# Altium schematic sheet DriverIC.SchDoc
size A4
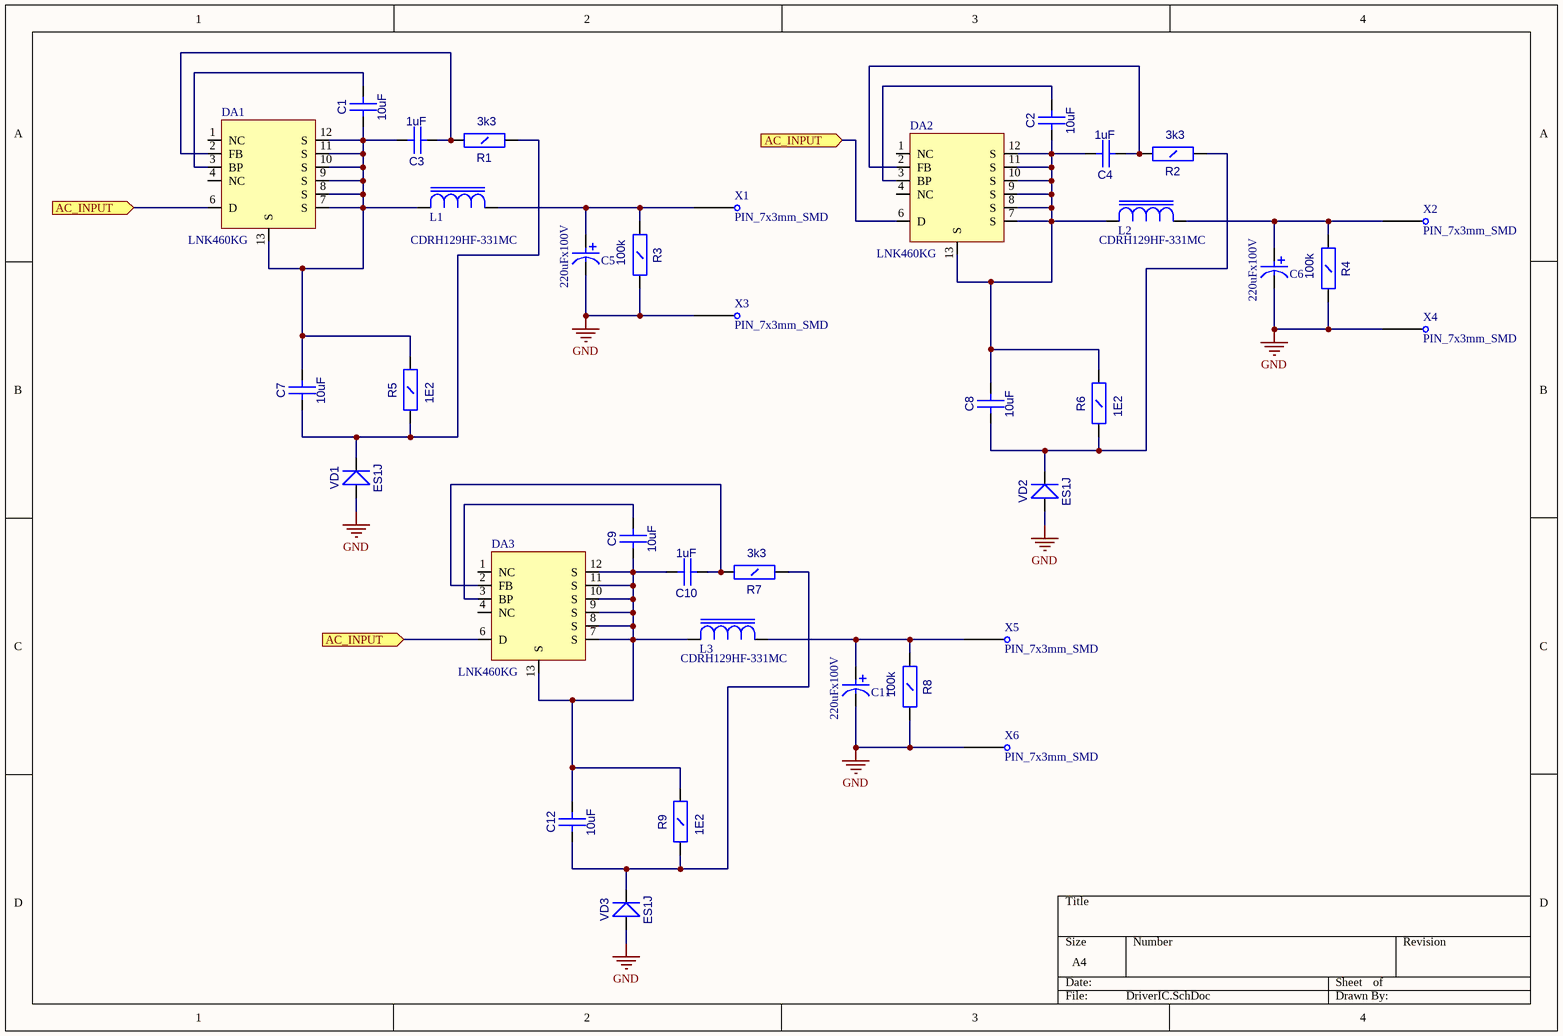
[diagram p0: DriverIC.SchDoc]

## Parts
C1  10uF  [CC1206]
C2  10uF  [CC1206]
C3  1uF  [CC1206]
C4  1uF  [CC1206]
C5  220uFx100V  [CAP_16x22_2]
C6  220uFx100V  [CAP_16x22_2]
C7  10uF  [CC1206]
C8  10uF  [CC1206]
C9  10uF  [CC1206]
C10  1uF  [CC1206]
C11  220uFx100V  [CAP_16x22_2]
C12  10uF  [CC1206]
DA1  LNK460KG  [eSOP-12]
DA2  LNK460KG  [eSOP-12]
DA3  LNK460KG  [eSOP-12]
L1  CDRH129HF-331MC  [IND_CDRH129]
L2  CDRH129HF-331MC  [IND_CDRH129]
L3  CDRH129HF-331MC  [IND_CDRH129]
R1  3k3  [RC1206]
R2  3k3  [RC1206]
R3  100k  [RC1206]
R4  100k  [RC1206]
R5  1E2  [RC1206]
R6  1E2  [RC1206]
R7  3k3  [RC1206]
R8  100k  [RC1206]
R9  1E2  [RC1206]
VD1  ES1J  [SMA]
VD2  ES1J  [SMA]
VD3  ES1J  [SMA]
X1  PIN_7x3mm_SMD  [PIN_7x3mm_SMD]
X2  PIN_7x3mm_SMD  [PIN_7x3mm_SMD]
X3  PIN_7x3mm_SMD  [PIN_7x3mm_SMD]
X4  PIN_7x3mm_SMD  [PIN_7x3mm_SMD]
X5  PIN_7x3mm_SMD  [PIN_7x3mm_SMD]
X6  PIN_7x3mm_SMD  [PIN_7x3mm_SMD]

## Ports
AC_INPUT (in)

## Nets
GND: C5.1 C6.1 C11.1 R3.2(B) R4.2(B) R8.2(B) VD1.1(A) VD2.1(A) VD3.1(A) X3.1 X4.1 X6.1
AC_INPUT: DA1.6(D) DA2.6(D) DA3.6(D) ; port AC_INPUT
NetC1_1: C1.1(A) C3.2(B) C7.2(B) DA1.7(S) DA1.8(S) DA1.9(S) DA1.10(S) DA1.11(S) DA1.12(S) DA1.13(S) L1.1(A) R5.2(B)
NetC1_2: C1.2(B) DA1.3(BP)
NetC2_1: C2.1(A) C4.2(B) C8.2(B) DA2.7(S) DA2.8(S) DA2.9(S) DA2.10(S) DA2.11(S) DA2.12(S) DA2.13(S) L2.1(A) R6.2(B)
NetC2_2: C2.2(B) DA2.3(BP)
NetC3_1: C3.1(A) DA1.2(FB) R1.2(B)
NetC4_1: C4.1(A) DA2.2(FB) R2.2(B)
NetC5_2: C5.2 L1.2(B) R3.1(A) X1.1
NetC6_2: C6.2 L2.2(B) R4.1(A) X2.1
NetC7_1: C7.1(A) R1.1(A) R5.1(A) VD1.2(K)
NetC8_1: C8.1(A) R2.1(A) R6.1(A) VD2.2(K)
NetC9_1: C9.1(A) C10.2(B) C12.2(B) DA3.7(S) DA3.8(S) DA3.9(S) DA3.10(S) DA3.11(S) DA3.12(S) DA3.13(S) L3.1(A) R9.2(B)
NetC9_2: C9.2(B) DA3.3(BP)
NetC10_1: C10.1(A) DA3.2(FB) R7.2(B)
NetC11_2: C11.2 L3.2(B) R8.1(A) X5.1
NetC12_1: C12.1(A) R7.1(A) R9.1(A) VD3.2(K)

Not connected (* = marked no-connect by the designer): DA1 1(NC) 4(NC); DA2 1(NC) 4(NC); DA3 1(NC) 4(NC)

## Library data of the parts
C1-C4 C7-C10 C12 = CC1206
  C1 C2 C7-C9 C12: Value: 10uF
  C3 C4 C10: Value: 1uF
C5 C6 C11 = CAP_16x22: Value: 220uFx100V
L1-L3 = CDRH129: Value: CDRH129HF-331MC
R1-R9 = RC1206
  R1 R2 R7: Value: 3k3
  R3 R4 R8: Value: 100k
  R5 R6 R9: Value: 1E2
VD1-VD3 = SS14: Schottky Rectifier; Value: ES1J
DA1-DA3 = LNK460KG: Value: LNK460KG